# Altium schematic sheet Sim.SchDoc
size A4
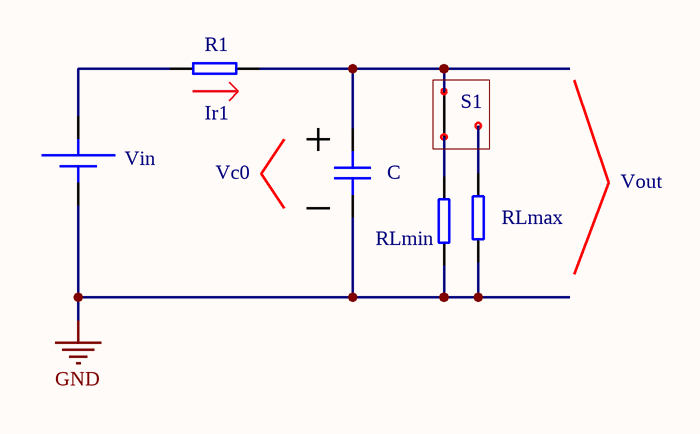
[diagram p0: Sim.SchDoc]

## Parts
C  10uF 50V  (value not drawn)
R1  10K 1/8W  (value not drawn)
RLmax  10K 1/8W  (value not drawn)
RLmin  10K 1/8W  (value not drawn)
Vin  10V  (value not drawn)  (no BOM)

## Nets
GND: C.2 RLmax.1 RLmin.1 Vin.2
NetC_1: C.1 R1.2
NetR1_1: R1.1 Vin.1

Not connected (* = marked no-connect by the designer): RLmax 2; RLmin 2

## Notes on the sheet
- (near R1) Ir1
- Vc0
- S1
- Vout

## Library data of the parts
C = CAP 10uF 50V SMD 0805: CERAMIC CAPACITOR 10uF 50V 5% -55C TO 125C SMD 0805; PART NUMBERS: Daagno Altium Library/Components; CODE: 010-000000-00; ORDERING PARAMETERS: 10uF 5% 50V -55C TO 125C; INITIAL VOLTAGE: 0V; ASSEMBLY: SMD; STATUS: PROTOTYPE; CATEGORY: CAPACITOR; VALUE: 10uF; SHORT DESCRIPTION: 10uF 50V
R1 RLmax RLmin = RES 10K 1/8W SMD 0805: CHIP RESISTOR 10K 1/8W 5% -55C TO 125C SMD 0805; PART NUMBERS: Daagno Altium Library/Components; CODE: 010-000000-00; ORDERING PARAMETERS: 10K 5% 1/8W -55C TO 125C; ASSEMBLY: SMD; STATUS: PROTOTYPE; CATEGORY: RESISTOR; VALUE: 10K; SHORT DESCRIPTION: 10K 1/8W
Vin = DC SOURCE: GENERIC DC SOURCE FOR SIMULATION; ASSEMBLY: NONE; AC MAGNITUDE: 0; CODE: NONE; PART NUMBERS: NONE; STATUS: SIMULATION; CATEGORY: POWER SUPPLY; FOOTPRINT: NONE; VALUE: 10V; SHORT DESCRIPTION: DC SOURCE; ORDERING PARAMETERS: NONE; AC PHASE: 0